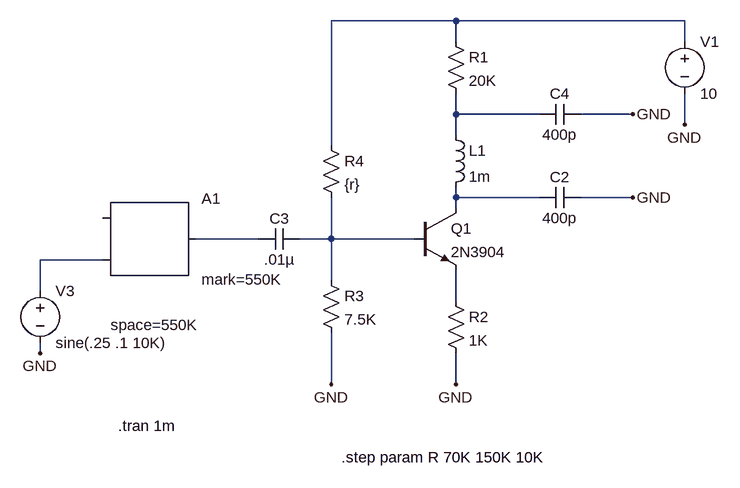
[diagram p0: schematic bjtAMdet.asc]
bjtAMdet.asc, the LTspice schematic file:
Version 4
SHEET 1 940 752
WIRE 528 352 528 336
WIRE 528 240 528 208
WIRE 880 224 880 176
WIRE 880 96 880 64
WIRE 880 64 528 64
WIRE 528 624 528 576
WIRE 528 96 528 64
WIRE 464 400 336 400
WIRE 336 400 336 464
WIRE 336 544 336 624
WIRE 336 400 288 400
WIRE 224 400 128 400
WIRE -112 560 -112 576
WIRE -16 432 -112 432
WIRE -112 432 -112 480
WIRE 528 208 656 208
WIRE 720 208 800 208
WIRE 528 208 528 176
WIRE 800 336 720 336
WIRE 656 336 528 336
WIRE 528 336 528 320
WIRE 336 400 336 336
WIRE 336 256 336 64
WIRE 336 64 528 64
WIRE 528 496 528 448
FLAG 528 624 GND
FLAG 880 224 GND
FLAG 336 624 GND
FLAG -112 576 GND
FLAG 800 336 GND
FLAG 800 208 GND
SYMBOL ind 512 224 R0
SYMATTR InstName L1
SYMATTR Value 1m
SYMBOL voltage 880 80 R0
SYMATTR InstName V1
SYMATTR Value 10
SYMBOL res 512 80 R0
SYMATTR InstName R1
SYMATTR Value 20K
SYMBOL res 320 448 R0
SYMATTR InstName R3
SYMATTR Value 7.5K
SYMBOL cap 288 384 R90
WINDOW 0 0 32 VBottom 0
WINDOW 3 32 32 VTop 0
SYMATTR InstName C3
SYMATTR Value .01µ
SYMBOL SpecialFunctions\modulate -16 368 R0
WINDOW 123 12 164 Left 0
SYMATTR InstName A1
SYMATTR Value mark=550K
SYMATTR Value2 space=550K
SYMBOL voltage -112 464 R0
SYMATTR InstName V3
SYMATTR Value sine(.25 .1 10K)
SYMBOL cap 720 320 R90
WINDOW 0 0 32 VBottom 0
WINDOW 3 32 32 VTop 0
SYMATTR InstName C2
SYMATTR Value 400p
SYMBOL cap 720 192 R90
WINDOW 0 0 32 VBottom 0
WINDOW 3 32 32 VTop 0
SYMATTR InstName C4
SYMATTR Value 400p
SYMBOL npn 464 352 R0
SYMATTR InstName Q1
SYMATTR Value 2N3904
SYMBOL res 320 240 R0
SYMATTR InstName R4
SYMATTR Value {r}
SYMBOL res 512 480 R0
SYMATTR InstName R2
SYMATTR Value 1K
text 8 688 Left 0 !.tran 1m
text 352 736 Left 0 !.step param R 70K 150K 10K

The netlist it stands for:
* bjtAMdet.asc
L1 N002 N001 1m
V1 N003 GND 10
R1 N003 N002 20K
R3 N004 GND 7.5K
C3 N004 N005 .01µ
A1 0 N006 0 0 0 0 N005 0 MODULATOR mark=550K space=550K
V3 N006 GND sine(.25 .1 10K)
C2 GND N001 400p
C4 GND N002 400p
Q1 N001 N004 N007 0 2N3904
R4 N003 N004 {r}
R2 N007 GND 1K
.model NPN NPN
.model PNP PNP
.lib standard.bjt
.tran 1m
.step param R 70K 150K 10K
.backanno
.end